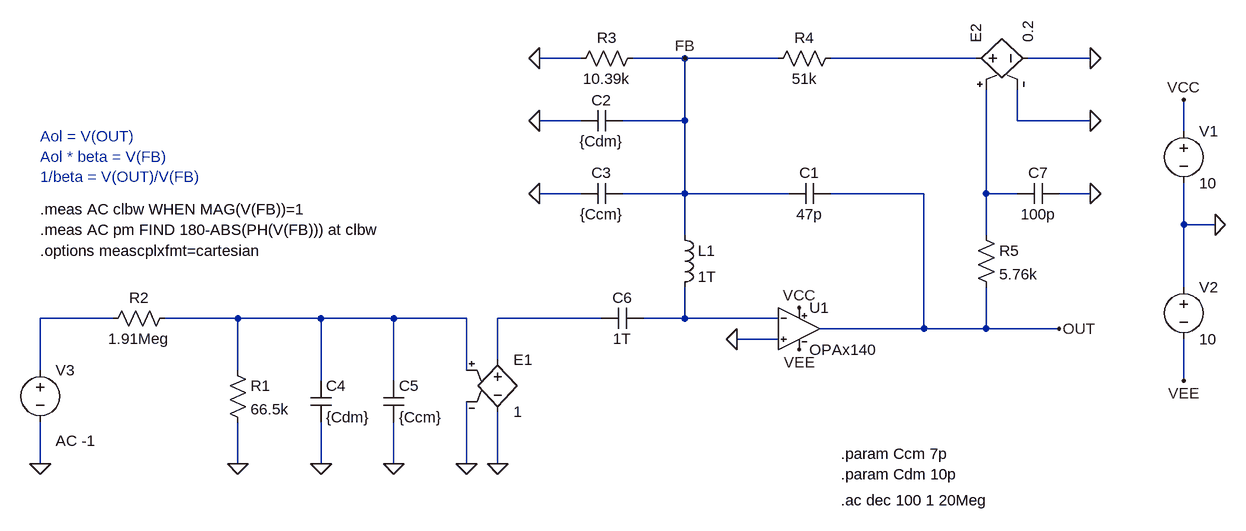
[diagram p0: schematic op-amp-bandwidth.asc]
op-amp-bandwidth.asc, the LTspice schematic file:
Version 4
SHEET 1 1796 916
WIRE -416 -256 -480 -256
WIRE -256 -256 -336 -256
WIRE -112 -256 -256 -256
WIRE 192 -256 -32 -256
WIRE 368 -256 272 -256
WIRE -416 -160 -480 -160
WIRE -256 -160 -256 -256
WIRE -256 -160 -352 -160
WIRE 256 -160 256 -208
WIRE 368 -160 256 -160
WIRE 512 -144 512 -192
WIRE -416 -48 -480 -48
WIRE -256 -48 -256 -160
WIRE -256 -48 -352 -48
WIRE -96 -48 -256 -48
WIRE 112 -48 -32 -48
WIRE 208 -48 208 -208
WIRE 256 -48 208 -48
WIRE 368 -48 320 -48
WIRE 512 0 512 -64
WIRE 560 0 512 0
WIRE -256 16 -256 -48
WIRE 208 16 208 -48
WIRE 512 96 512 0
WIRE -1136 144 -1248 144
WIRE -944 144 -1056 144
WIRE -816 144 -944 144
WIRE -704 144 -816 144
WIRE -592 144 -704 144
WIRE -384 144 -544 144
WIRE -256 144 -256 96
WIRE -256 144 -320 144
WIRE -112 144 -256 144
WIRE 112 160 112 -48
WIRE 112 160 -48 160
WIRE 208 160 208 96
WIRE 208 160 112 160
WIRE 320 160 208 160
WIRE -112 176 -176 176
WIRE -544 208 -544 144
WIRE -1248 224 -1248 144
WIRE -944 224 -944 144
WIRE -592 224 -592 144
WIRE -816 240 -816 144
WIRE -704 240 -704 144
WIRE 512 240 512 176
WIRE -1248 368 -1248 304
WIRE -944 368 -944 304
WIRE -816 368 -816 304
WIRE -704 368 -704 304
WIRE -592 368 -592 272
WIRE -544 368 -544 288
FLAG 560 0 0
FLAG -1248 368 0
FLAG 512 -192 VCC
FLAG -80 128 VCC
FLAG -80 192 VEE
FLAG 512 240 VEE
FLAG -944 368 0
FLAG -480 -256 0
FLAG -256 -256 FB
FLAG 320 160 OUT
FLAG -480 -48 0
FLAG -176 176 0
FLAG -480 -160 0
FLAG -592 368 0
FLAG -544 368 0
FLAG -704 368 0
FLAG -816 368 0
FLAG 368 -48 0
FLAG 368 -256 0
FLAG 368 -160 0
SYMBOL voltage 512 -160 R0
WINDOW 123 0 0 Left 0
WINDOW 39 0 0 Left 0
SYMATTR InstName V1
SYMATTR Value 10
SYMBOL voltage 512 80 R0
WINDOW 123 0 0 Left 0
WINDOW 39 0 0 Left 0
SYMATTR InstName V2
SYMATTR Value 10
SYMBOL voltage -1248 208 R0
WINDOW 123 24 124 Left 2
WINDOW 39 0 0 Left 0
SYMATTR Value2 AC -1
SYMATTR InstName V3
SYMATTR Value ""
SYMBOL ind -272 0 R0
SYMATTR InstName L1
SYMATTR Value 1T
SYMBOL res -1040 128 R90
WINDOW 0 0 56 VBottom 2
WINDOW 3 32 56 VTop 2
SYMATTR InstName R2
SYMATTR Value 1.91Meg
SYMBOL res -960 208 R0
SYMATTR InstName R1
SYMATTR Value 66.5k
SYMBOL res -320 -272 R90
WINDOW 0 0 56 VBottom 2
WINDOW 3 32 56 VTop 2
SYMATTR InstName R3
SYMATTR Value 10.39k
SYMBOL res -16 -272 R90
WINDOW 0 0 56 VBottom 2
WINDOW 3 32 56 VTop 2
SYMATTR InstName R4
SYMATTR Value 51k
SYMBOL cap -320 128 R90
WINDOW 0 0 32 VBottom 2
WINDOW 3 32 32 VTop 2
SYMATTR InstName C6
SYMATTR Value 1T
SYMBOL cap -352 -64 R90
WINDOW 0 0 32 VBottom 2
WINDOW 3 32 32 VTop 2
SYMATTR InstName C3
SYMATTR Value {Ccm}
SYMBOL cap -352 -176 R90
WINDOW 0 0 32 VBottom 2
WINDOW 3 32 32 VTop 2
SYMATTR InstName C2
SYMATTR Value {Cdm}
SYMBOL e -544 192 R0
SYMATTR InstName E1
SYMATTR Value 1
SYMBOL OPAx140 -80 160 R0
SYMATTR InstName U1
SYMBOL cap -32 -64 R90
WINDOW 0 0 32 VBottom 2
WINDOW 3 32 32 VTop 2
SYMATTR InstName C1
SYMATTR Value 47p
SYMBOL cap -720 240 R0
SYMATTR InstName C5
SYMATTR Value {Ccm}
SYMBOL cap -832 240 R0
SYMATTR InstName C4
SYMATTR Value {Cdm}
SYMBOL res 192 0 R0
SYMATTR InstName R5
SYMATTR Value 5.76k
SYMBOL cap 320 -64 R90
WINDOW 0 0 32 VBottom 2
WINDOW 3 32 32 VTop 2
SYMATTR InstName C7
SYMATTR Value 100p
SYMBOL e 176 -256 R270
SYMATTR InstName E2
SYMATTR Value 0.2
TEXT -16 424 Left 2 !.ac dec 100 1 20Meg
TEXT -1248 -136 Left 2 ;Aol = V(OUT)\nAol * beta = V(FB)\n1/beta = V(OUT)/V(FB)
TEXT -16 352 Left 2 !.param Ccm 7p
TEXT -16 384 Left 2 !.param Cdm 10p
TEXT -1248 -24 Left 2 !.meas AC clbw WHEN MAG(V(FB))=1
TEXT -1248 8 Left 2 !.meas AC pm FIND 180-ABS(PH(V(FB))) at clbw
TEXT -1248 40 Left 2 !.options meascplxfmt=cartesian

The netlist it stands for:
* op-amp-bandwidth.asc
V1 VCC 0 10
V2 0 VEE 10
V3 N003 0 AC -1
L1 FB N006 1T
R2 N004 N003 1.91Meg
R1 N004 0 66.5k
R3 FB 0 10.39k
R4 N001 FB 51k
C6 N006 N005 1T
C3 FB 0 {Ccm}
C2 FB 0 {Cdm}
E1 N005 0 N004 0 1
XU1 0 N006 VCC VEE OUT OPAx140  ; pins In+ In- V+ V- OUT
C1 OUT FB 47p
C5 N004 0 {Ccm}
C4 N004 0 {Cdm}
R5 N002 OUT 5.76k
C7 0 N002 100p
E2 N001 0 N002 0 0.2
.ac dec 100 1 20Meg
* Aol = V(OUT)
* Aol * beta = V(FB)
* 1/beta = V(OUT)/V(FB)
.param Ccm 7p
.param Cdm 10p
.meas AC clbw WHEN MAG(V(FB))=1
.meas AC pm FIND 180-ABS(PH(V(FB))) at clbw
.options meascplxfmt=cartesian
.lib OPAx140.LIB
.backanno
.end